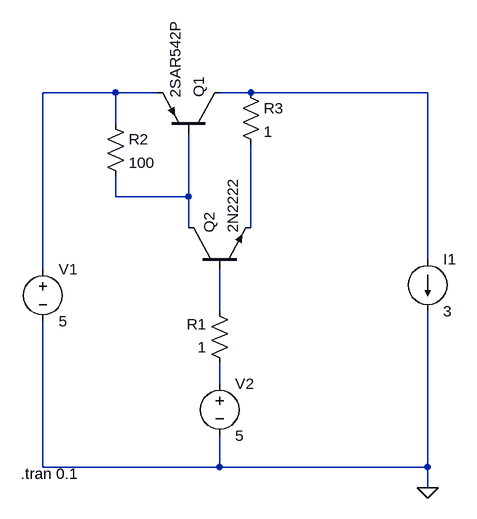
[diagram p0: schematic sziklai_dropout.asc]
sziklai_dropout.asc, the LTspice schematic file:
Version 4
SHEET 1 880 680
WIRE 128 48 16 48
WIRE 192 48 128 48
WIRE 336 48 288 48
WIRE 608 48 336 48
WIRE 128 96 128 48
WIRE 128 208 128 176
WIRE 240 208 240 112
WIRE 240 208 128 208
WIRE 240 256 240 208
WIRE 336 256 336 128
WIRE 608 304 608 48
WIRE 16 320 16 48
WIRE 288 384 288 320
WIRE 288 496 288 464
WIRE 16 624 16 400
WIRE 288 624 288 576
WIRE 288 624 16 624
WIRE 608 624 608 384
WIRE 608 624 288 624
WIRE 608 656 608 624
FLAG 608 656 0
SYMBOL pnp 288 112 M270
SYMATTR InstName Q1
SYMATTR Value 2SAR542P
SYMBOL npn 240 320 R270
SYMATTR InstName Q2
SYMATTR Value 2N2222
SYMBOL voltage 16 304 R0
WINDOW 123 0 0 Left 0
WINDOW 39 0 0 Left 0
SYMATTR InstName V1
SYMATTR Value 5
SYMBOL current 608 304 R0
WINDOW 123 0 0 Left 0
WINDOW 39 0 0 Left 0
SYMATTR InstName I1
SYMATTR Value 3
SYMBOL voltage 288 480 R0
WINDOW 123 0 0 Left 0
WINDOW 39 0 0 Left 0
SYMATTR InstName V2
SYMATTR Value 5
SYMBOL res 304 480 R180
WINDOW 0 36 76 Left 2
WINDOW 3 36 40 Left 2
SYMATTR InstName R1
SYMATTR Value 1
SYMBOL res 112 80 R0
SYMATTR InstName R2
SYMATTR Value 100
SYMBOL res 320 32 R0
SYMATTR InstName R3
SYMATTR Value 1
TEXT -18 634 Left 2 !.tran 0.1

The netlist it stands for:
* sziklai_dropout.asc
Q1 N002 N003 N001 0 2SAR542P
Q2 N003 N005 N004 0 2N2222
V1 N001 0 5
I1 N002 0 3
V2 N006 0 5
R1 N006 N005 1
R2 N001 N003 100
R3 N002 N004 1
.model NPN NPN
.model PNP PNP
.lib standard.bjt
.tran 0.1
.backanno
.end